# EAGLE schematic mainframe (EAGLE 9.2.2)

## Sheet 1 of 3: Z80
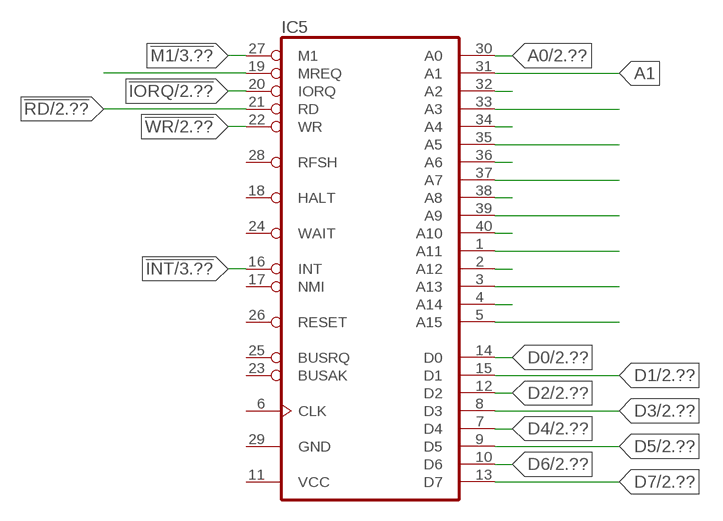
[diagram p0: schematic, sheet 1]

### Parts
IC5  Z80CPU  [DIL40]

### Nets
!INT: IC5.16(INT) ; also sheet 3
!IORQ: IC5.20(IORQ) ; also sheet 2,3
!M1: IC5.27(M1) ; also sheet 3
!RD: IC5.21(RD) ; also sheet 2
!WR: IC5.22(WR) ; also sheet 2
A0: IC5.30(A0) ; also sheet 2
A1: IC5.31(A1)
D0: IC5.14(D0) ; also sheet 2,3
D1: IC5.15(D1) ; also sheet 2,3
D2: IC5.12(D2) ; also sheet 2,3
D3: IC5.8(D3) ; also sheet 2,3
D4: IC5.7(D4) ; also sheet 2,3
D5: IC5.9(D5) ; also sheet 2,3
D6: IC5.10(D6) ; also sheet 2,3
D7: IC5.13(D7) ; also sheet 2,3
N$5: IC5.19(MREQ)
N$6: IC5.32(A2)
N$7: IC5.33(A3)
N$8: IC5.34(A4)
N$9: IC5.35(A5)
N$10: IC5.36(A6)
N$20: IC5.37(A7)
N$22: IC5.38(A8)
N$23: IC5.39(A9)
N$24: IC5.40(A10)
N$25: IC5.1(A11)
N$26: IC5.2(A12)
N$27: IC5.3(A13)
N$28: IC5.4(A14)
N$29: IC5.5(A15)
Unconnected: IC5.6(CLK) IC5.17(NMI) IC5.18(HALT) IC5.23(BUSAK) IC5.24(WAIT) IC5.25(BUSRQ) IC5.26(RESET) IC5.28(RFSH)

## Sheet 2 of 3: I/O Inteface
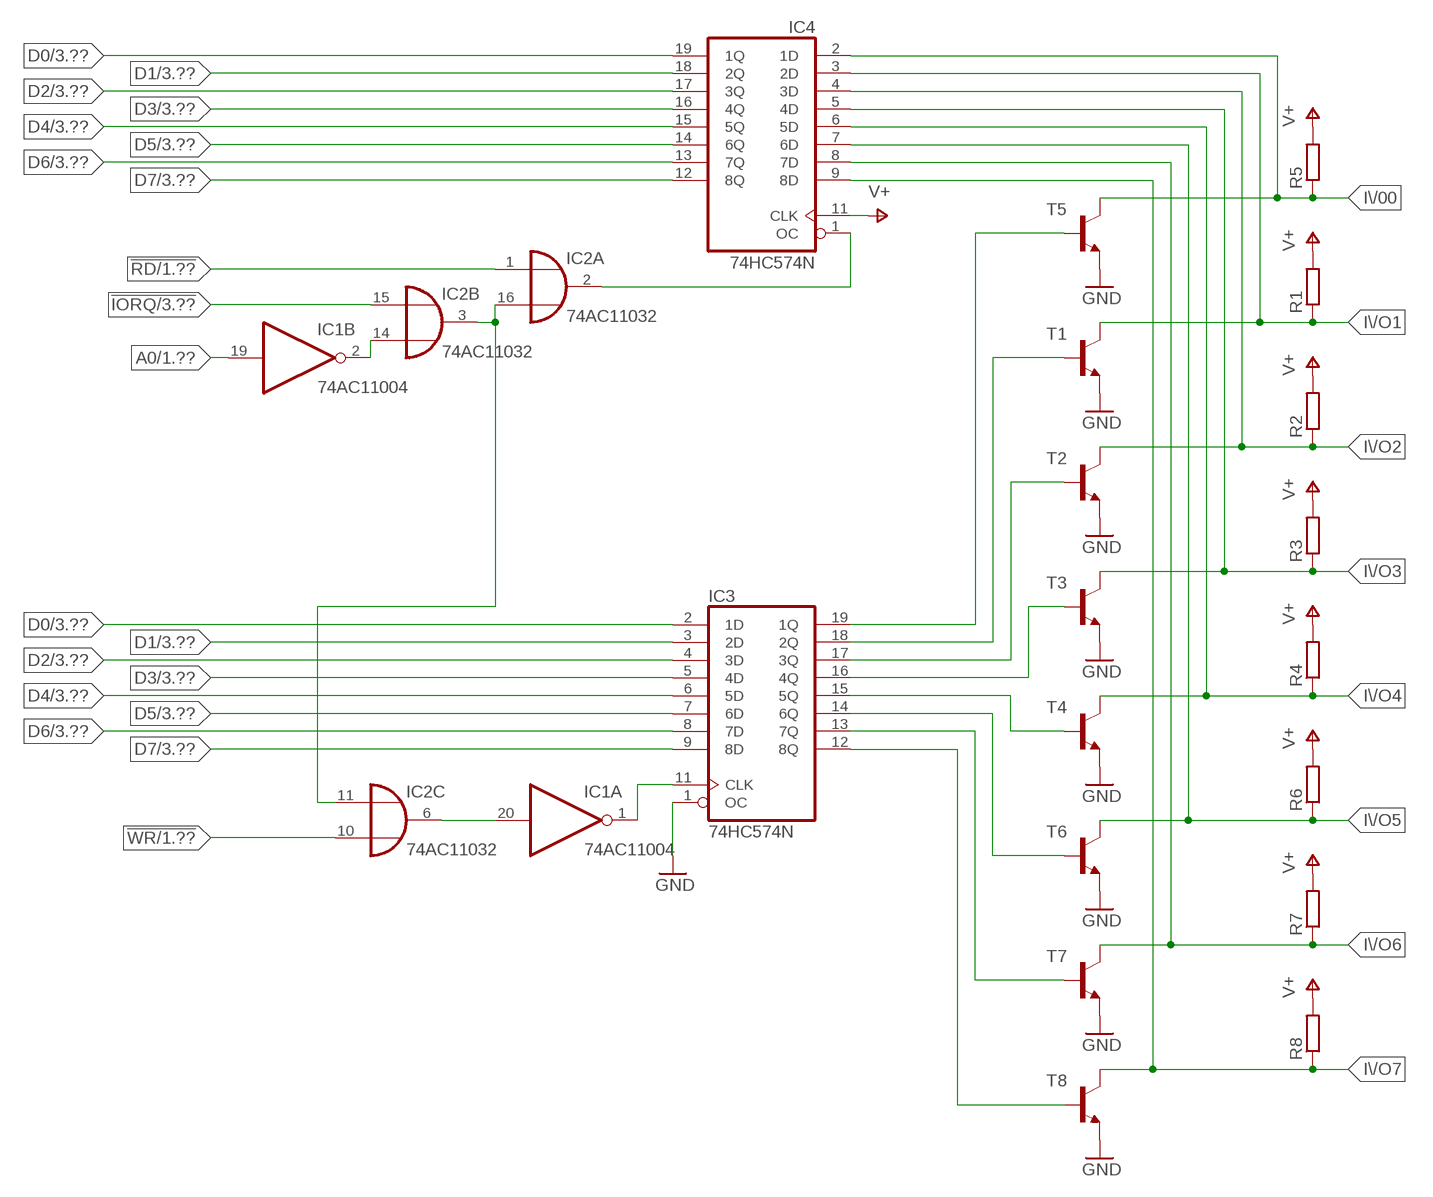
[diagram p1: schematic, sheet 2]

### Parts
IC1  74AC11004  [DIL20]
IC2  74AC11032  [DIL16]
IC3  74HC574N  [DIL20]
IC4  74HC574N  [DIL20]
R1  R-EU_0204/5  [0204/5]
R2  R-EU_0204/5  [0204/5]
R3  R-EU_0204/5  [0204/5]
R4  R-EU_0204/5  [0204/5]
R5  R-EU_0204/5  [0204/5]
R6  R-EU_0204/5  [0204/5]
R7  R-EU_0204/5  [0204/5]
R8  R-EU_0204/5  [0204/5]
T1  2N5550-NPN-TO92-CBE  [TO92-CBE]
T2  2N5550-NPN-TO92-CBE  [TO92-CBE]
T3  2N5550-NPN-TO92-CBE  [TO92-CBE]
T4  2N5550-NPN-TO92-CBE  [TO92-CBE]
T5  2N5550-NPN-TO92-CBE  [TO92-CBE]
T6  2N5550-NPN-TO92-CBE  [TO92-CBE]
T7  2N5550-NPN-TO92-CBE  [TO92-CBE]
T8  2N5550-NPN-TO92-CBE  [TO92-CBE]

### Nets
!IORQ: IC2.15(B:I1) ; also sheet 1,3
!RD: IC2.1(A:I1) ; also sheet 1
!WR: IC2.10(C:I2) ; also sheet 1
A0: IC1.19(B:I) ; also sheet 1
D0: IC3.2(1D) IC4.19(1Q) ; also sheet 1,3
D1: IC3.3(2D) IC4.18(2Q) ; also sheet 1,3
D2: IC3.4(3D) IC4.17(3Q) ; also sheet 1,3
D3: IC3.5(4D) IC4.16(4Q) ; also sheet 1,3
D4: IC3.6(5D) IC4.15(5Q) ; also sheet 1,3
D5: IC3.7(6D) IC4.14(6Q) ; also sheet 1,3
D6: IC3.8(7D) IC4.13(7Q) ; also sheet 1,3
D7: IC3.9(8D) IC4.12(8Q) ; also sheet 1,3
GND: IC3.1(OC) T1.E T2.E T3.E T4.E T5.E T6.E T7.E T8.E
I\/00: IC4.2(1D) R5.1 T5.C
I\/O1: IC4.3(2D) R1.1 T1.C
I\/O2: IC4.4(3D) R2.1 T2.C
I\/O3: IC4.5(4D) R3.1 T3.C
I\/O4: IC4.6(5D) R4.1 T4.C
I\/O5: IC4.7(6D) R6.1 T6.C
I\/O6: IC4.8(7D) R7.1 T7.C
I\/O7: IC4.9(8D) R8.1 T8.C
N$1: IC1.1(A:O) IC3.11(CLK)
N$2: IC1.20(A:I) IC2.6(C:O)
N$3: IC2.3(B:O) IC2.11(C:I1) IC2.16(A:I2)
N$11: IC3.12(8Q) T8.B
N$12: IC3.13(7Q) T7.B
N$13: IC3.14(6Q) T6.B
N$14: IC3.15(5Q) T4.B
N$15: IC3.16(4Q) T3.B
N$16: IC3.17(3Q) T2.B
N$17: IC3.18(2Q) T1.B
N$18: IC3.19(1Q) T5.B
N$19: IC2.2(A:O) IC4.1(OC)
N$21: IC1.2(B:O) IC2.14(B:I2)
V+: IC4.11(CLK) R1.2 R2.2 R3.2 R4.2 R5.2 R6.2 R7.2 R8.2 ; also sheet 3
Unconnected: IC1.3(C:O) IC1.8(D:O) IC1.9(E:O) IC1.10(F:O) IC1.11(F:I) IC1.12(E:I) IC1.13(D:I) IC1.18(C:I) IC2.7(D:O) IC2.8(D:I2) IC2.9(D:I1)

## Sheet 3 of 3: Interrupt
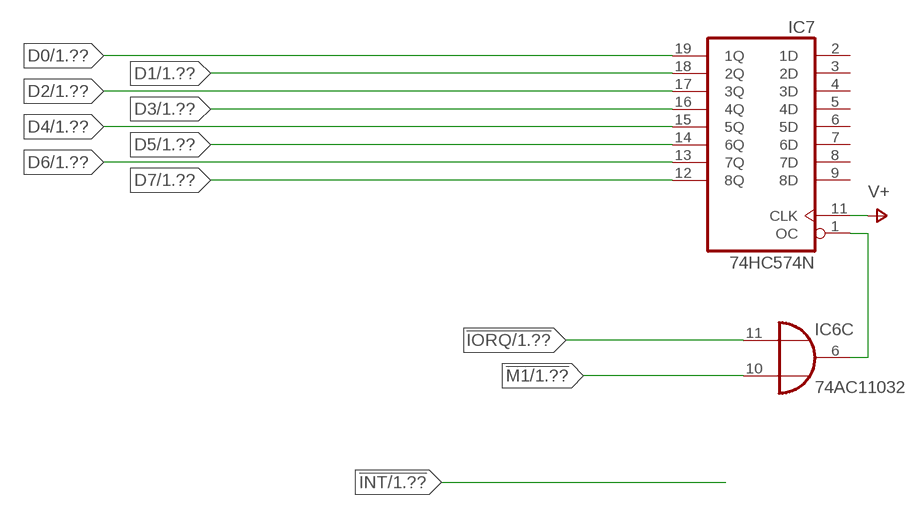
[diagram p2: schematic, sheet 3]

### Parts
IC6  74AC11032  [DIL16]
IC7  74HC574N  [DIL20]

### Nets
!IORQ: IC6.11(C:I1) ; also sheet 1,2
!M1: IC6.10(C:I2) ; also sheet 1
D0: IC7.19(1Q) ; also sheet 1,2
D1: IC7.18(2Q) ; also sheet 1,2
D2: IC7.17(3Q) ; also sheet 1,2
D3: IC7.16(4Q) ; also sheet 1,2
D4: IC7.15(5Q) ; also sheet 1,2
D5: IC7.14(6Q) ; also sheet 1,2
D6: IC7.13(7Q) ; also sheet 1,2
D7: IC7.12(8Q) ; also sheet 1,2
N$4: IC6.6(C:O) IC7.1(OC)
V+: IC7.11(CLK) ; also sheet 2
Unconnected: IC6.1(A:I1) IC6.2(A:O) IC6.3(B:O) IC6.7(D:O) IC6.8(D:I2) IC6.9(D:I1) IC6.14(B:I2) IC6.15(B:I1) IC6.16(A:I2) IC7.2(1D) IC7.3(2D) IC7.4(3D) IC7.5(4D) IC7.6(5D) IC7.7(6D) IC7.8(7D) IC7.9(8D)

## Power pins joined to a net without a drawn wire
GND: IC1.4(P:GND) IC1.5(P:GND) IC1.6(P:GND) IC1.7(P:GND) IC2.4(P:GND) IC2.5(P:GND) IC3.10(GND) IC4.10(GND) IC5.29(GND) IC6.4(P:GND) IC6.5(P:GND) IC7.10(GND)
VCC: IC1.15(P:VCC) IC1.16(P:VCC) IC2.12(P:VCC) IC2.13(P:VCC) IC3.20(VCC) IC4.20(VCC) IC5.11(VCC) IC6.12(P:VCC) IC6.13(P:VCC) IC7.20(VCC)

## Library data of the parts
IC1 = 74ac-logic:74AC11004: Hex INVERTER
IC2 IC6 = 74ac-logic:74AC11032: Quadruple 2-input OR
IC3 IC4 IC7 = 74xx-eu:74*574: 8-bit D type FLIP FLOP bus driver
IC5 = zilog:Z80CPU: Z80 FAMILY DEVICE
R1-R8 = rcl:R-EU_: RESISTOR, European symbol; SPICEPREFIX: R
T1-T8 = transistor:*-NPN-: NPN Transistror BF959 corrected 2008.03.06